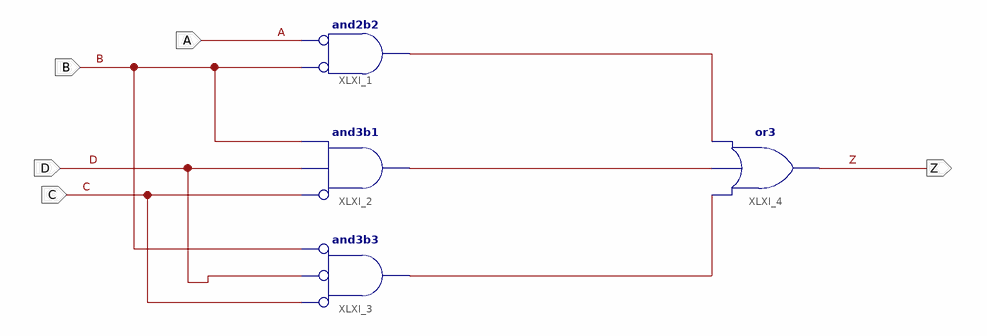
[diagram p0: schematic sheet 1]
// Xilinx ISE schematic p1ej2a.sch (spartan3) as structural Verilog: 4 symbols, 5 ports
module p1ej2a (
  input  A,
  input  B,
  input  D,
  input  C,
  output Z
);

  wire XLXN_1, XLXN_2, XLXN_3;

  and XLXI_1 (XLXN_3, ~B, ~A);  // and2b2
  and XLXI_2 (XLXN_2, ~C, D, B);  // and3b1
  and XLXI_3 (XLXN_1, ~C, ~D, ~B);  // and3b3
  or XLXI_4 (Z, XLXN_1, XLXN_2, XLXN_3);
endmodule
